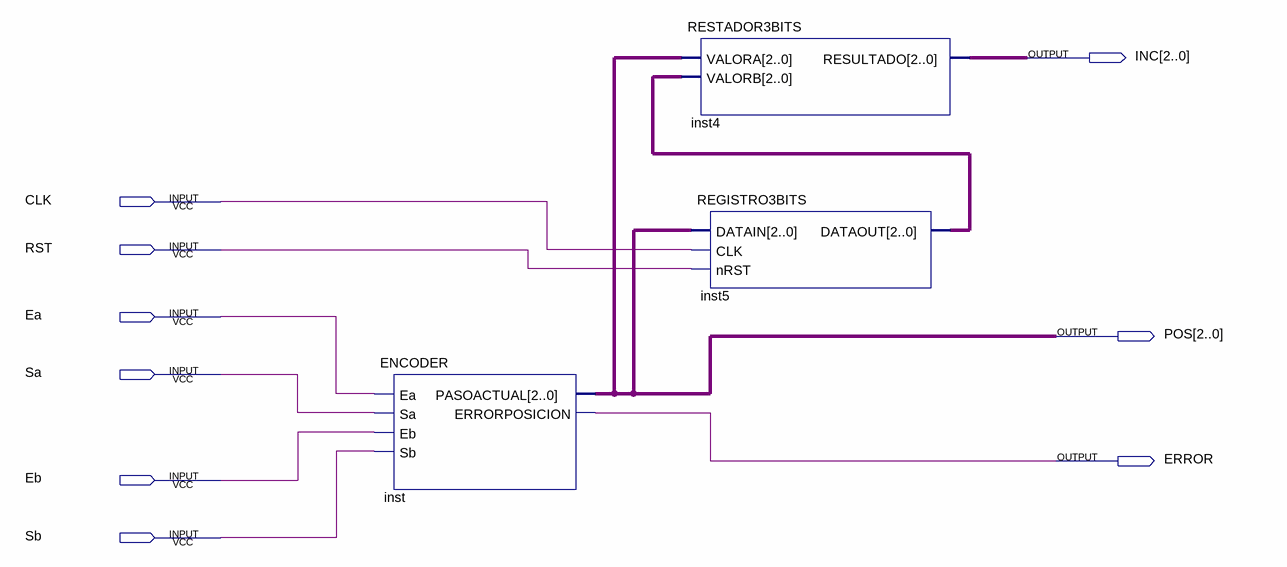
[diagram p0: schematic sheet]
// Quartus schematic VERIFICADOR.bdf as structural Verilog: 3 symbols, 9 pins
module VERIFICADOR (
  input  CLK,
  input  RST,
  input  Ea,
  input  Sa,
  input  Eb,
  input  Sb,
  output [2:0] INC,
  output [2:0] POS,
  output ERROR
);

  wire [2:0] inst5_dataout;

  ENCODER inst (.Ea(Ea), .Sa(Sa), .Eb(Eb), .Sb(Sb), .PASOACTUAL(POS), .ERRORPOSICION(ERROR));
  RESTADOR3BITS inst4 (.VALORA(POS), .VALORB(inst5_dataout), .RESULTADO(INC));
  REGISTRO3BITS inst5 (.DATAIN(POS), .CLK(CLK), .nRST(RST), .DATAOUT(inst5_dataout));
endmodule
